# Altium schematic sheet Connectors-DAC-Controllers.SchDoc
size A4; SheetNumber: 3; SheetTotal: 6
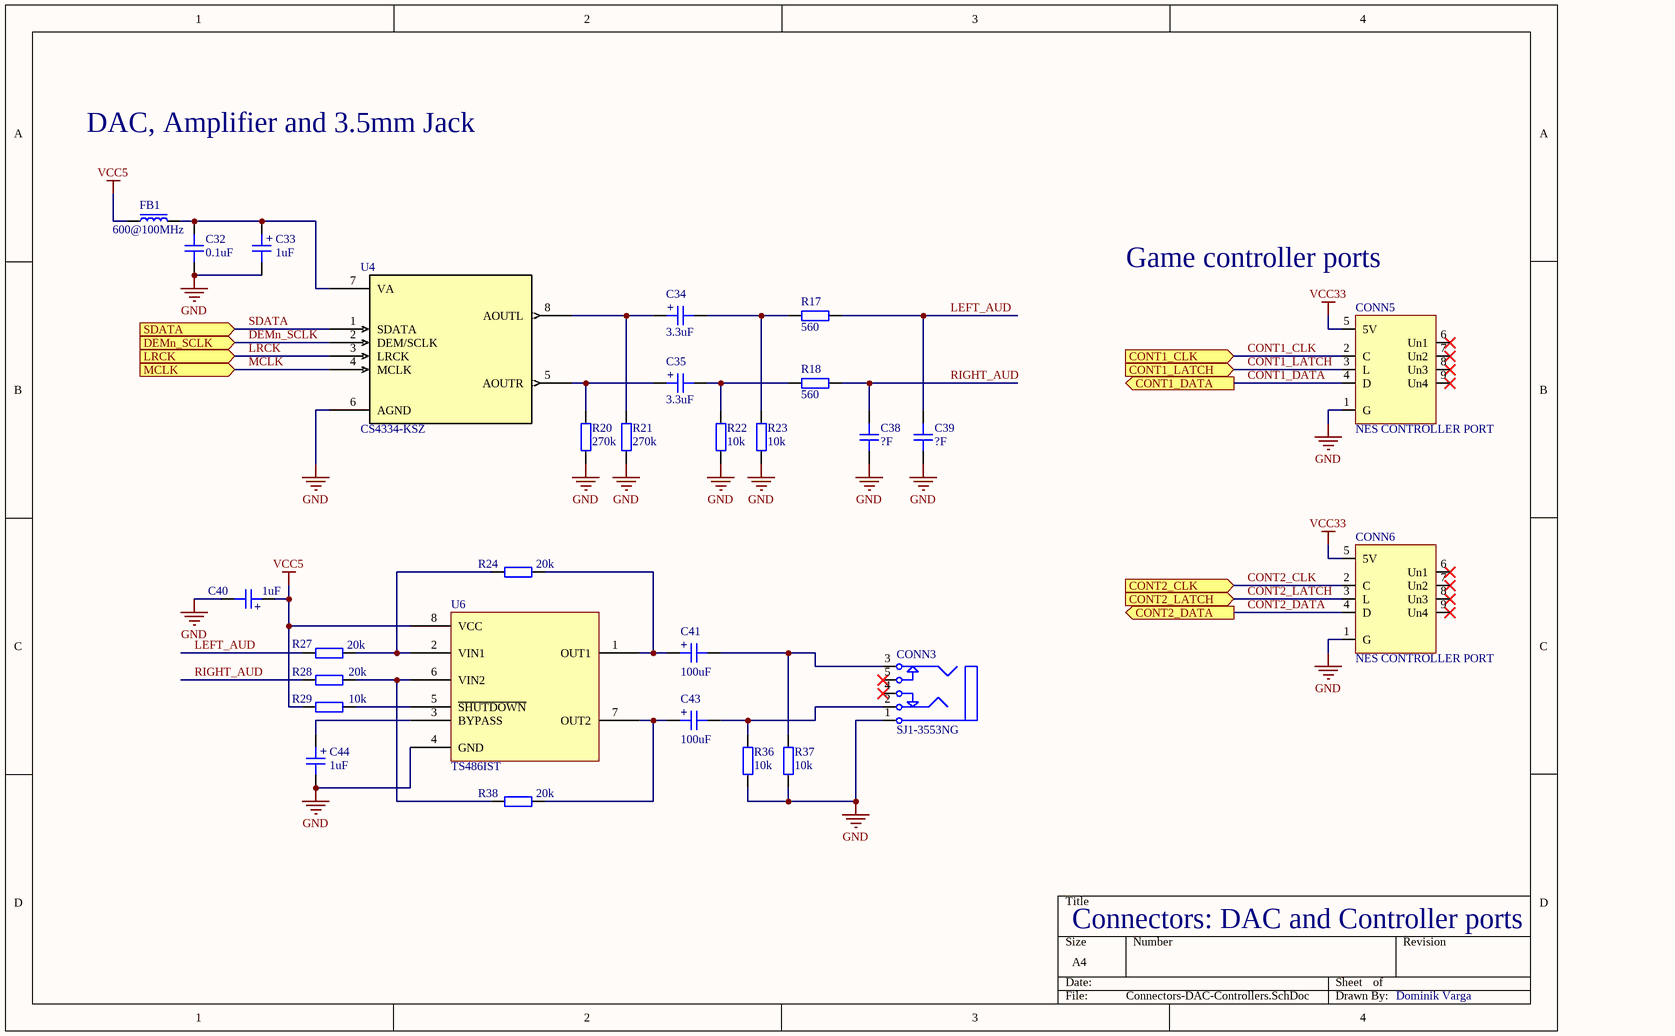
[diagram p0: Connectors-DAC-Controllers.SchDoc]

## Parts
C32  0.1uF  [CAP_SMD0805]
C33  1uF  [CAPMP3216X180N]
C34  3.3uF  [CAPMP3216X180N]
C35  3.3uF  [CAPMP3216X180N]
C38  ?F  [CAP_SMD1206]
C39  ?F  [CAP_SMD1206]
C40  1uF  [CAPMP3216X180N]
C41  100uF  [CAPMP7343X310N]
C43  100uF  [CAPMP7343X310N]
C44  1uF  [CAPMP3216X180N]
CONN3  SJ1-3553NG  [SJ1-3553NG]
CONN5  NES CONTROLLER PORT  [NES controller port]
CONN6  NES CONTROLLER PORT  [NES controller port]
FB1  600@100MHz  [IND_SMD1206]
R17  560  [RES_SMD0603]
R18  560  [RES_SMD0603]
R20  270k  [RES_SMD0603]
R21  270k  [RES_SMD0603]
R22  10k  [RES_SMD0603]
R23  10k  [RES_SMD0603]
R24  20k  [RES_SMD0603]
R27  20k  [RES_SMD0603]
R28  20k  [RES_SMD0603]
R29  10k  [RES_SMD0603]
R36  10k  [RES_SMD0603]
R37  10k  [RES_SMD0603]
R38  20k  [RES_SMD0603]
U4  CS4334-KSZ  [SOIC127P600X175-8N]
U6  TS486IST  [SOP65P490X109-8N]

## Ports
CONT1_CLK (in, see FPGA-IO-BANKS[2D]), CONT1_DATA (out, see FPGA-IO-BANKS[2D]), CONT1_LATCH (in, see FPGA-IO-BANKS[2D]), CONT2_CLK (in, see FPGA-IO-BANKS[2D]), CONT2_DATA (out, see FPGA-IO-BANKS[3A]), CONT2_LATCH (in, see FPGA-IO-BANKS[3A]), DEMn_SCLK (in, see FPGA-IO-BANKS[2B]), LRCK (in, see FPGA-IO-BANKS[2B]), MCLK (in, see FPGA-IO-BANKS[2B]), SDATA (in, see FPGA-IO-BANKS[2A])

## Nets
GND: C32.1 C33.2 C38.1 C39.1 C40.2 C44.2 CONN3.1 CONN5.1(G) CONN6.1(G) R20.2 R21.2 R22.2 R23.2 R36.1 R37.1 U4.6(AGND) U6.4(GND)
VCC5: C40.1 FB1.1 R29.1 U6.8(VCC)
VCC33: CONN5.5(5V) CONN6.5(5V)
CONT1_CLK: CONN5.2(C) ; port CONT1_CLK
CONT1_DATA: CONN5.4(D) ; port CONT1_DATA
CONT1_LATCH: CONN5.3(L) ; port CONT1_LATCH
CONT2_CLK: CONN6.2(C) ; port CONT2_CLK
CONT2_DATA: CONN6.4(D) ; port CONT2_DATA
CONT2_LATCH: CONN6.3(L) ; port CONT2_LATCH
DEMn_SCLK: U4.2(DEM/SCLK) ; port DEMn_SCLK
LEFT_AUD: C39.2 R17.2 R27.1
LRCK: U4.3(LRCK) ; port LRCK
MCLK: U4.4(MCLK) ; port MCLK
RIGHT_AUD: C38.2 R18.2 R28.1
SDATA: U4.1(SDATA) ; port SDATA
NetC32_2: C32.2 C33.1 FB1.2 U4.7(VA)
NetC34_1: C34.1 R21.1 U4.8(AOUTL)
NetC34_2: C34.2 R17.1 R23.1
NetC35_1: C35.1 R20.1 U4.5(AOUTR)
NetC35_2: C35.2 R18.1 R22.1
NetC41_1: C41.1 R24.2 U6.1(OUT1)
NetC41_2: C41.2 CONN3.3 R37.2
NetC43_1: C43.1 R38.2 U6.7(OUT2)
NetC43_2: C43.2 CONN3.2 R36.2
NetC44_1: C44.1 U6.3(BYPASS)
NetR24_1: R24.1 R27.2 U6.2(VIN1)
NetR28_2: R28.2 R38.1 U6.6(VIN2)
NetR29_2: R29.2 U6.5(~{SHUTDOWN})

Not connected (* = marked no-connect by the designer): CONN3 4* 5*; CONN5 6(Un1)* 7(Un2)* 8(Un3)* 9(Un4)*; CONN6 6(Un1)* 7(Un2)* 8(Un3)* 9(Un4)*

## Notes on the sheet
- DAC, Amplifier and 3.5mm Jack
- Game controller ports
- Connectors: DAC and Controller ports
- Dominik Varga
- (in symbol CAP_ALEL_A) +
- (in symbol CAP_ALEL_D) +

## Library data of the parts
C32 = CAP_0805: Capacitor SMD 0805
C33-C35 C40 C44 = CAP_ALEL_A: Capacitor SMD Tantal A 16V; Manufacturer: *; Manufacturer Part Number: *
C38 C39 = CAP_1206: Capacitor SMD 1206 NP0 Dielektrikum
C41 C43 = CAP_ALEL_D: Capacitor SMD Tantal D 20V; Manufacturer: *; Manufacturer Part Number: *
CONN3 = SJ1-3553NG: CUI SJ1-3553NG 3.5mm jack receptacle; Published: 5-Jan-2004; LatestRevisionDate: 17-Dec-2003; LatestRevisionNote: PCB Footprint replaced.; DatasheetDocument: 07-Mar-2000; Publisher: Altium Limited; ComponentLink1Description: Manufacturer Link; ComponentLink1URL: http://domino.kycon.com/internet/Products.html
FB1 = FB_1206: Ferrite Bead SMD 1206
R17 R18 R20-R24 R27-R29 R36-R38 = RES_0603: Resistor SMD 0603
U4 = CS4334-KSZ: DAC 2-CH Delta-Sigma 24-bit 8-Pin SOIC; Mfr_Name: Cirrus Logic; Copyright: Copyright (C) 2023 Ultra Librarian. All rights reserved.; Manufacturer_Part_Number: CS4334-KSZ; RefDes: RefDes; Type: DEV
U6 = TS486IST: 100mW STEREO HEADPHONE AMPLIFIER WITH STANDBY / MODE